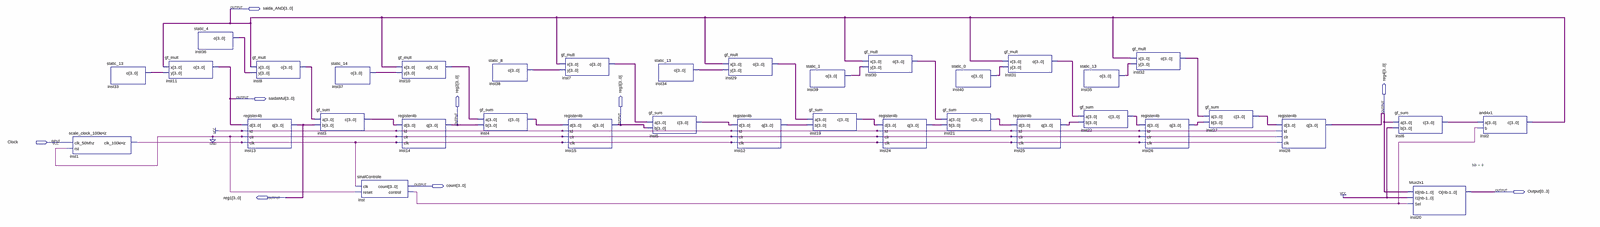
[diagram p0: schematic sheet, whole]
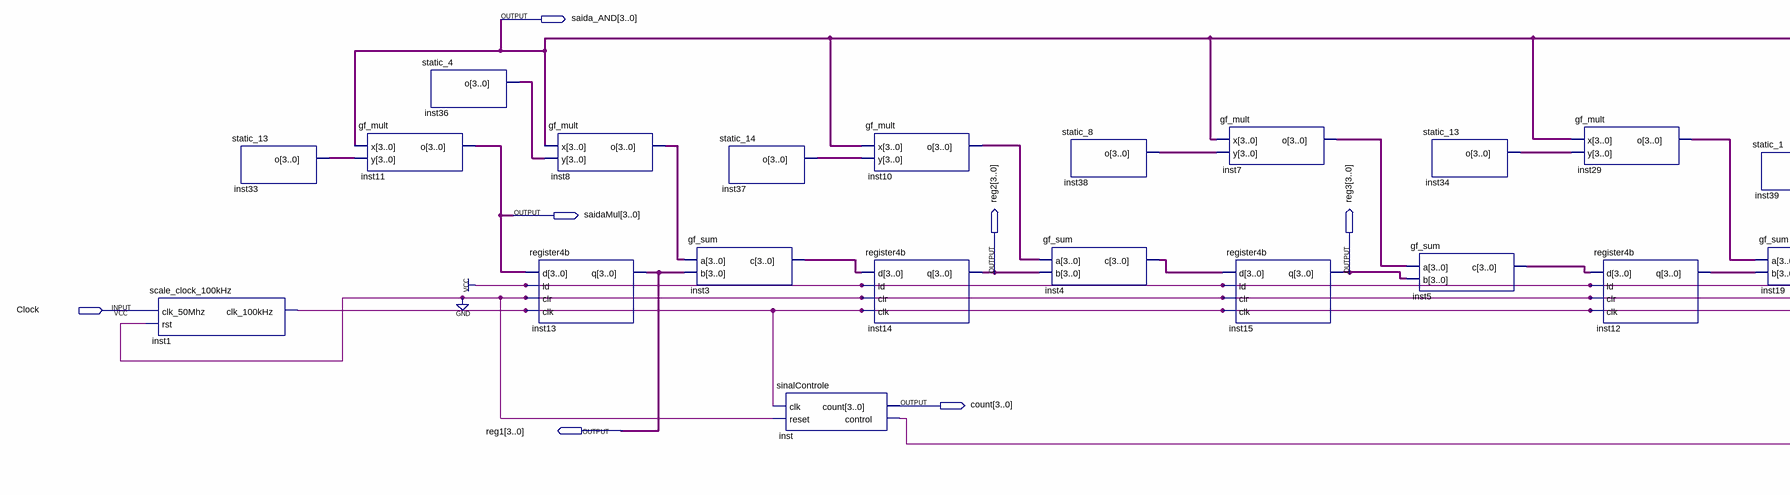
[diagram p1: schematic sheet, left part]
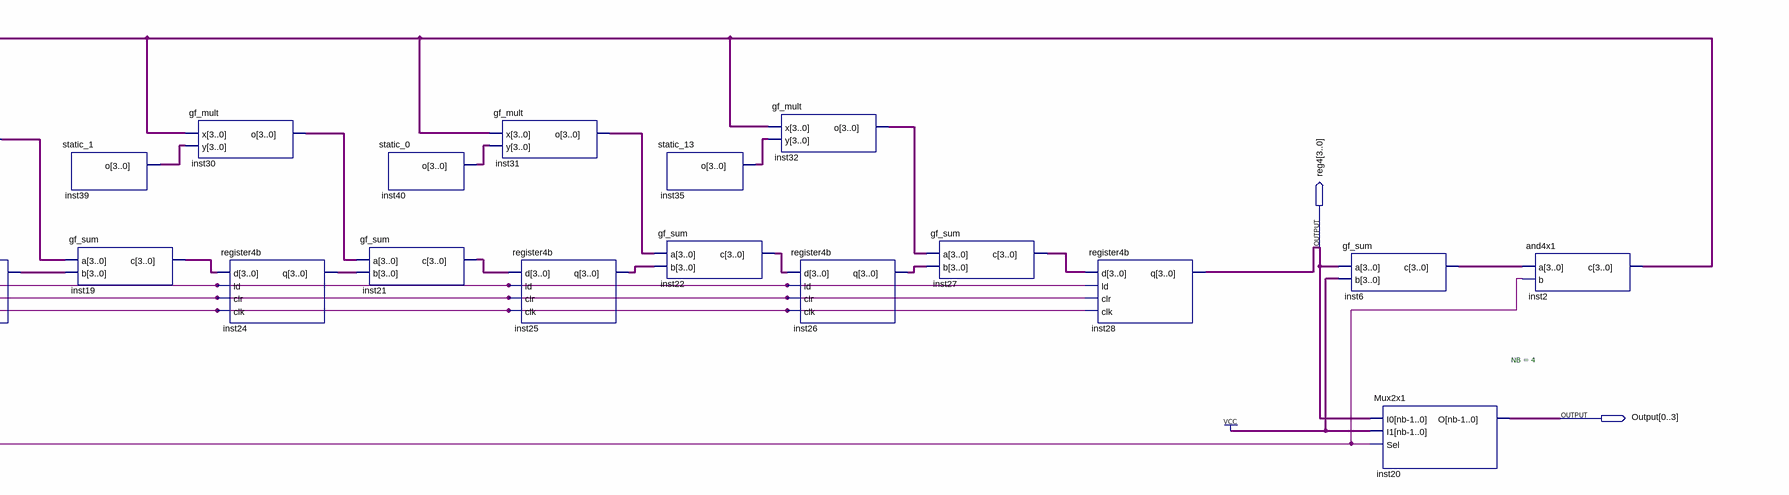
[diagram p2: schematic sheet, right part]
// Quartus schematic RSencoder.bdf as structural Verilog: 36 symbols, 9 pins
module RSencoder (
  input  Clock,
  output [3:0] saida_AND,
  output [3:0] saidaMul,
  output [3:0] reg4,
  output [3:0] reg2,
  output [3:0] reg3,
  output [3:0] count,
  output [0:3] Output,
  output [3:0] reg1
);

  wire inst1_clk_100khz, inst_control;
  wire [3:0] inst3_c, inst4_c, inst5_c, inst6_c, inst7_o, inst8_o, inst10_o, inst12_q, inst19_c, inst21_c,
       inst22_c, inst24_q, inst25_q, inst26_q, inst27_c, inst29_o, inst30_o, inst31_o, inst32_o, inst33_o,
       inst34_o, inst35_o, inst36_o, inst37_o, inst38_o, inst39_o, inst40_o;

  scale_clock_100kHz inst1 (.clk_50Mhz(Clock), .rst(1'b0), .clk_100kHz(inst1_clk_100khz));
  static_13 inst33 (.o(inst33_o));
  gf_mult inst11 (.x(saida_AND), .y(inst33_o), .o(saidaMul));
  static_4 inst36 (.o(inst36_o));
  gf_mult inst8 (.x(saida_AND), .y(inst36_o), .o(inst8_o));
  register4b inst13 (.d(saidaMul), .ld(1'b1), .clr(1'b0), .clk(inst1_clk_100khz), .q(reg1));
  gf_sum inst3 (.a(inst8_o), .b(reg1), .c(inst3_c));
  static_14 inst37 (.o(inst37_o));
  sinalControle inst (.clk(inst1_clk_100khz), .reset(1'b0), .count(count), .control(inst_control));
  gf_mult inst10 (.x(saida_AND), .y(inst37_o), .o(inst10_o));
  register4b inst14 (.d(inst3_c), .ld(1'b1), .clr(1'b0), .clk(inst1_clk_100khz), .q(reg2));
  gf_sum inst4 (.a(inst10_o), .b(reg2), .c(inst4_c));
  static_8 inst38 (.o(inst38_o));
  gf_mult inst7 (.x(saida_AND), .y(inst38_o), .o(inst7_o));
  register4b inst15 (.d(inst4_c), .ld(1'b1), .clr(1'b0), .clk(inst1_clk_100khz), .q(reg3));
  gf_sum inst5 (.a(inst7_o), .b(reg3), .c(inst5_c));
  static_13 inst34 (.o(inst34_o));
  gf_mult inst29 (.x(saida_AND), .y(inst34_o), .o(inst29_o));
  register4b inst12 (.d(inst5_c), .ld(1'b1), .clr(1'b0), .clk(inst1_clk_100khz), .q(inst12_q));
  static_1 inst39 (.o(inst39_o));
  gf_sum inst19 (.a(inst29_o), .b(inst12_q), .c(inst19_c));
  gf_mult inst30 (.x(saida_AND), .y(inst39_o), .o(inst30_o));
  register4b inst24 (.d(inst19_c), .ld(1'b1), .clr(1'b0), .clk(inst1_clk_100khz), .q(inst24_q));
  static_0 inst40 (.o(inst40_o));
  gf_sum inst21 (.a(inst30_o), .b(inst24_q), .c(inst21_c));
  gf_mult inst31 (.x(saida_AND), .y(inst40_o), .o(inst31_o));
  register4b inst25 (.d(inst21_c), .ld(1'b1), .clr(1'b0), .clk(inst1_clk_100khz), .q(inst25_q));
  static_13 inst35 (.o(inst35_o));
  gf_sum inst22 (.a(inst31_o), .b(inst25_q), .c(inst22_c));
  gf_mult inst32 (.x(saida_AND), .y(inst35_o), .o(inst32_o));
  register4b inst26 (.d(inst22_c), .ld(1'b1), .clr(1'b0), .clk(inst1_clk_100khz), .q(inst26_q));
  gf_sum inst27 (.a(inst32_o), .b(inst26_q), .c(inst27_c));
  register4b inst28 (.d(inst27_c), .ld(1'b1), .clr(1'b0), .clk(inst1_clk_100khz), .q(reg4));
  gf_sum inst6 (.a(reg4), .b(4'b1111), .c(inst6_c));
  Mux2x1 #(.NB(4)) inst20 (.I0(reg4), .I1(4'b1111), .Sel(inst_control), .O(Output));
  and4x1 inst2 (.a(inst6_c), .b(inst_control), .c(saida_AND));
endmodule
